# Altium schematic sheet eval.SchDoc
size A4; SheetNumber: 2; SheetTotal: 2
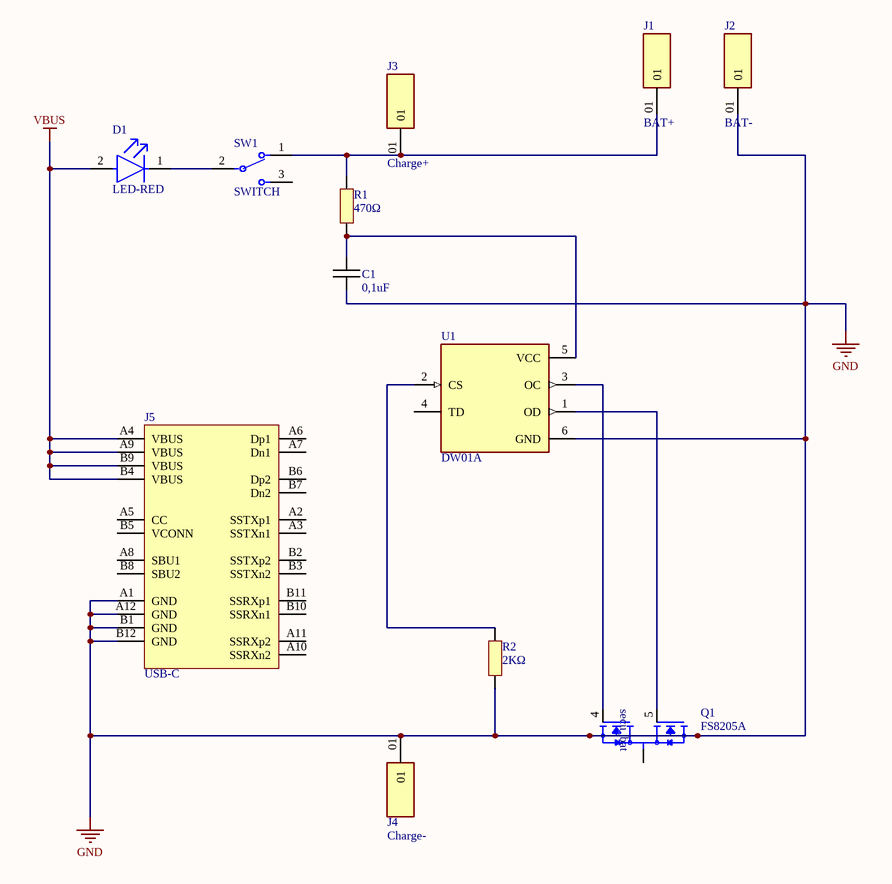
[diagram p0: eval.SchDoc]

## Parts
C1  0,1uF  [SMD-1005-CAP]
D1  LED-RED  [SMD-1608-LED]
J1  BAT+  [HEADER]
J2  BAT-  [HEADER]
J3  Charge+  [HEADER]
J4  Charge-  [HEADER]
J5  USB-C  [USB-C]
Q1  FS8205A  [FS8205A]
R1  470Ω  [SMD-1005-RES]
R2  2KΩ  [SMD-1005-RES]
SW1  SWITCH  [SMD-SWITCH]
U1  DW01A  [DW01A]

## Nets
GND: C1.2 J2.01 J4.01 J5.A1(GND) J5.A12(GND) J5.B1(GND) J5.B12(GND) Q1.2(S1) Q1.3(S1) Q1.6(S2) Q1.7(S2) R2.2 U1.6(GND)
VBUS: D1.2(A) J5.A4(VBUS) J5.A9(VBUS) J5.B4(VBUS) J5.B9(VBUS)
NetC1_1: C1.1 R1.1 U1.5(VCC)
NetD1_1: D1.1(C) SW1.2(C)
NetJ1_01: J1.01 J3.01 R1.2 SW1.1
NetQ1_1: Q1.1(D12) Q1.8(D12)
NetQ1_4: Q1.4(G1) U1.3(OC)
NetQ1_5: Q1.5(G2) U1.1(OD)
NetR2_1: R2.1 U1.2(CS)

Not connected (* = marked no-connect by the designer): J5 A2(SSTXp1) A3(SSTXn1) A5(CC) A6(Dp1) A7(Dn1) A8(SBU1) A10(SSRXn2) A11(SSRXp2) B2(SSTXp2) B3(SSTXn2) B5(VCONN) B6(Dp2) B7(Dn2) B8(SBU2) B10(SSRXn1) B11(SSRXp1); SW1 3; U1 4(TD)

## Notes on the sheet
- (near Q1) secu_bat

## Library data of the parts
C1 = CAPACITOR
D1 = LED-RED: LED GREEN CLEAR CHIP SMD LTST-C190GKT; Dominant Wavelength: 569nm; Reverse Voltage: 5V; Lens Color: Colorless; Viewing Angle: 130°; Voltage: 2V; Forward Current: 30mA; Power Dissipation: 100mW; Luminous Intensity: 6mcd; Number of LEDs: 1; Forward Voltage: 2.1V; Wavelength: 565nm; Test Current: 10mA; Min Operating Temperature: -55°C; Lens Style: Clear; Mount: Surface Mount; Width: 0.8mm; Packaging: Tape and Reel; Lens Transparency: Clear; Case Code (Metric): 1608; Depth: 0.8mm; Case Code (Imperial): 0603; Case/Package: 0603; Number of Pins: 2; Max Operating Temperature: 85°C; Lead Free: Lead Free; Number of Elements: 1; Length: 1.6mm; Height: 0.8mm; Package Quantity: 1; Power Rating: 100mW; Radiation Hardening: No; Illumination Color: Green; Color: Green
J1-J4 = HEADER: Connector Header Through Hole 1 position; MF: Samtec; MP: MTMM-101-05-G-S-225; SnapEDA_Link: https://www.snapeda.com/parts/MTMM-101-05-G-S-225/Samtec/view-part/?ref=snap; Package: None; Value: *; Check_prices: https://www.snapeda.com/parts/MTMM-101-05-G-S-225/Samtec/view-part/?ref=eda
J5 = USB-C: NexarPartId: 68112675; Pin Length: 1.9mm; Current Rating: 5A; Gender: Receptacle; Voltage Rating: 20V; Number of Contacts: 24; Insulation Resistance: 1GΩ; USB Standard: USB 3.1; Connector Type: USB; Contact Resistance: 30mΩ; Min Operating Temperature: -40°C; Mount: Surface Mount, Through Hole; Height: 3.21mm; Number of Pins: 24; RoHS: Compliant; Orientation: Horizontal; Max Operating Temperature: 105°C; Packaging: Tape and Reel; Contact Material: Gold, Nickel
Q1 = FS8205A: N/A; MF: Fortune Semiconductor; MP: FS8205A; Value: *; Availability: Not in stock; Package: Package; Price: None; SnapEDA_Link: https://www.snapeda.com/parts/FS8205A/Fortune+Semiconductor/view-part/?ref=snap; Check_prices: https://www.snapeda.com/parts/FS8205A/Fortune+Semiconductor/view-part/?ref=eda
R1 R2 = RESISTOR
SW1 = SWITCH: SWITCH SLIDE SPDT 300MA 6V JS102011SCQN; Electrical Life: 5000Cycles; Actuator Type: Standard; Contact Resistance: 70mR; Actuator Material: Nylon; Max Voltage Rating (DC): 30V; Actuator Length: 2mm; Switch Function: On-On; Actuator Color: Black; Radiation Hardening: No; Throw Configuration: SPDT; Depth: 7.5mm; Case/Package: SMD/SMT; Package Quantity: 4000; Min Operating Temperature: -40°C; Length: 8.5mm; Current Rating: 300mA; Mount: Surface Mount; Voltage Rating (DC): 6V; RoHS Compliant: Yes; Orientation: Straight; Housing Material: Nylon; Contact Plating: Silver; Max Operating Temperature: 85°C; Packaging: Tape and Reel; Switch Travel: 2mm; Max Current Rating: 300mA; Contact Material: Copper Alloy; Series: JS; Termination: Gull Wing
U1 = DW01A: One Cell Lithium-ion/Polymer Battery Protection IC; MF: Fortune Semiconductor; SnapEDA_Link: https://www.snapeda.com/parts/DW01A/Fortune+Semiconductor/view-part/?ref=snap; Package: SOT-23-6 Fortune Semiconductor; Value: *; MP: DW01A; Check_prices: https://www.snapeda.com/parts/DW01A/Fortune+Semiconductor/view-part/?ref=eda